# Altium project Plant.PrjPcb
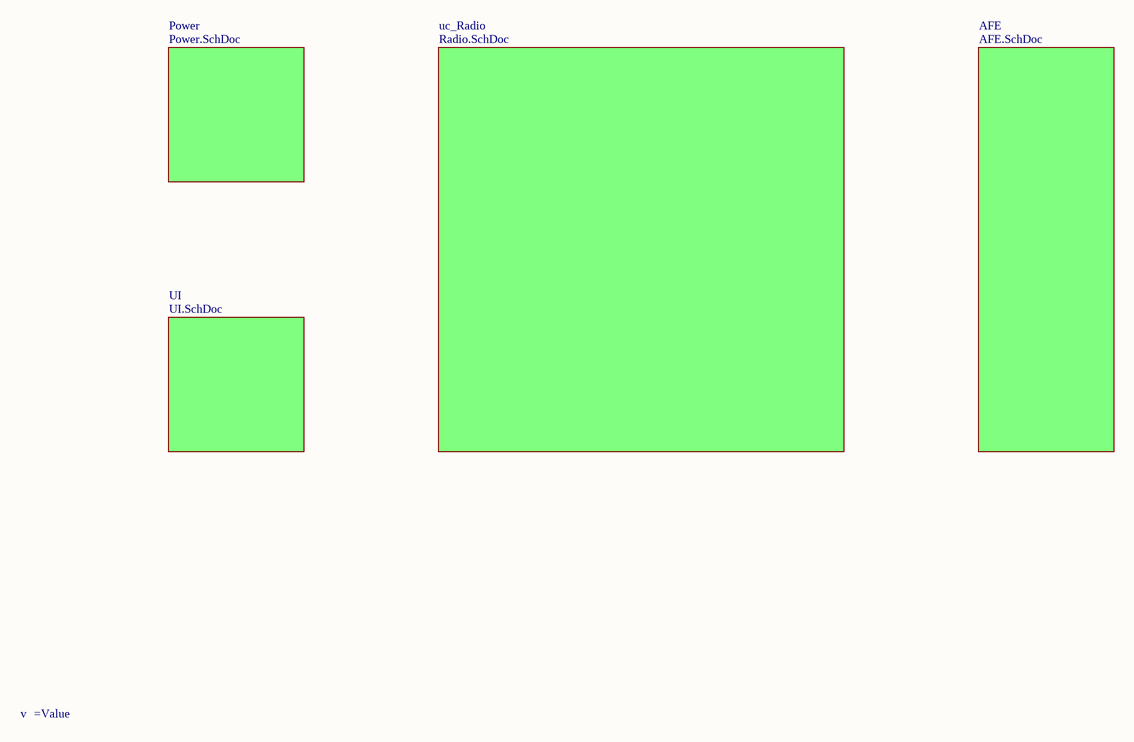
[diagram p0: Plant.SchDoc]
5 sheets, 30 parts. Net scope: global (net labels, ports and power ports of the same name join across sheets).
Board file: Plant.PcbDoc
Sheets:
  Plant.SchDoc
    uc_Radio = Radio.SchDoc
    Power = Power.SchDoc
    AFE = AFE.SchDoc
    UI = UI.SchDoc

## Sheet Plant.SchDoc: Plant - Block Diagram
size A4; Author: Carlos de la Fuente; DrawnBy: Carlos de la Fuente; Engineer: Carlos de la Fuente; DocumentNumber: 1; Revision: 0.2; SheetNumber: 1; SheetTotal: 5

### Parts
v  Version  [VERSION]  (value not drawn)  (no BOM)

### Sub-sheets
AFE = AFE.SchDoc: no entries
Power = Power.SchDoc: no entries
uc_Radio = Radio.SchDoc: no entries
UI = UI.SchDoc: no entries

### Notes on the sheet
- Title
- Size:
- Date:
- A4
- Project:
- Time:
- Sheet
- Drawn By:
- Revision:
- of
- File:

### Library data of the parts
v = Version: Silkscreen version; Value: 0.2; Part Number: Version; Revision Date: 15/04/2019; Creation Date: 15/04/2019

## Sheet Radio.SchDoc: Plant - Radio
size A4; Author: Carlos de la Fuente; DrawnBy: Carlos de la Fuente; DocumentNumber: Radio; Revision: 0.2; SheetNumber: 2; SheetTotal: 5
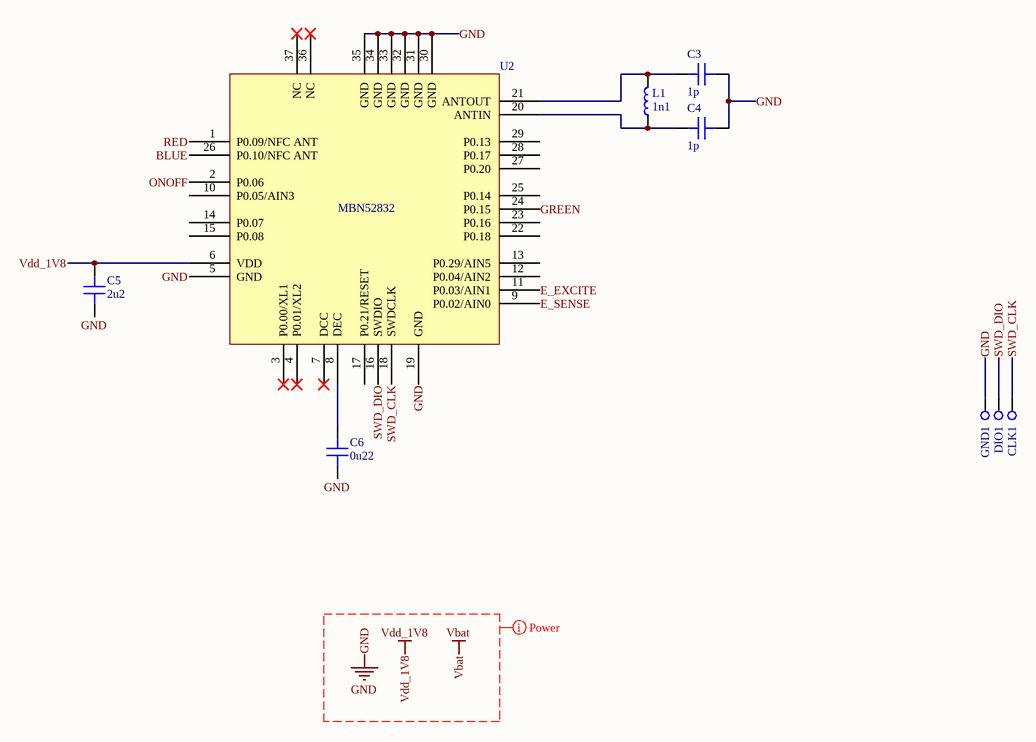
[diagram p1: Radio.SchDoc]

### Parts
C3  1p  [CAP 0201/0603]
C4  1p  [CAP 0201/0603]
C5  2u2  [CAP 0402/1005]
C6  0u22  [CAP 0201/0603]
CLK1  Test Point  [TP SMD 1MM]  (value not drawn)  (no BOM)
DIO1  Test Point  [TP SMD 1MM]  (value not drawn)  (no BOM)
GND1  Test Point  [TP SMD 1MM]  (value not drawn)  (no BOM)
L1  1n1  [FER 0402/1005]
U2  MBN52832  [Murata MBN52832]

### Nets
GND: C3.2 C4.2 C5.1 C6.1 GND1.1(TP) U2.5(GND) U2.19(GND) U2.30(GND) U2.31(GND) U2.32(GND) U2.33(GND) U2.34(GND) U2.35(GND)
Vdd_1V8: C5.2 U2.6(VDD)
BLUE: U2.26(P0.10/NFC_ANT)
E_EXCITE: U2.11(P0.03/AIN1)
E_SENSE: U2.9(P0.02/AIN0)
GREEN: U2.24(P0.15)
ONOFF: U2.2(P0.06)
RED: U2.1(P0.09/NFC_ANT)
SWD_CLK: CLK1.1(TP) U2.18(SWDCLK)
SWD_DIO: DIO1.1(TP) U2.16(SWDIO)
NetC3_1: C3.1 L1.2 U2.21(ANTOUT)
NetC4_1: C4.1 L1.1 U2.20(ANTIN)
NetC6_2: C6.2 U2.8(DEC)

Not connected (* = marked no-connect by the designer): U2 3(P0.00/XL1)* 4(P0.01/XL2)* 7(DCC)* 10(P0.05/AIN3) 12(P0.04/AIN2) 13(P0.29/AIN5) 14(P0.07) 15(P0.08) 17(P0.21/RESET) 22(P0.18) 23(P0.16) 25(P0.14) 27(P0.20) 28(P0.17) 29(P0.13) 36(NC)* 37(NC)*

### Layout directives
net class Power: GND, Vbat, Vdd_1V8

### Notes on the sheet
- Title
- Size:
- Date:
- A4
- Project:
- Time:
- Sheet
- Drawn By:
- Revision:
- of
- File:

### Library data of the parts
C3 C4 = GRM0335C1H1R0BA01D: CAP CER 0201 1pF 50V ±0.1pF C0G; Manufacturer: Murata; Value: 1p; Part Number: GRM0335C1H1R0BA01D; Creation Date: 02/07/2019; Revision Date: 02/07/2019; Supplier 1: Digi-Key; Supplier Part Number 1: 490-9660-1-ND; Manufacturer Part Number: GRM0335C1H1R0BA01D; Stock 1: 521200; Pricing 1: 1=0,10000, 10=0,02000, 100=0,00900, 500=0,00644, 1000=0,00506, 2500=0,00460, 5000=0,00423 (USD); RoHS: Yes; Mount: Surface Mount; Case/Package: 0201; Min Operating Temperature: -55°C; Max Operating Temperature: 125°C; Packaging: Tape and Reel; Voltage Rating (DC): 50V; Length: 0.024inch; Width: 0.012inch; Depth: 0.3mm; ComponentLink1URL: https://datasheet.ciiva.com/29538/partnumbering-e-01-29538566.pdf?src-supplier=Digi-Key; ComponentLink1Description: https://datasheet.ciiva.com/29538/partnumbering-e-01-29538566.pdf?src-supplier=Digi-Key; Case Code (Imperial): 0201; Case Code (Metric): 0603; Voltage Rating: 50V; Package Quantity: 15000; Termination: SMD/SMT; Capacitance: 1pF; Dielectric: C0G; Thickness: 0.013inch
C5 = GRM155R61C225KE11D: CAP CER 0402 2.2uF 16V 10% X5R; Manufacturer: Murata; Note: recommended; Material: Ceramic; Value: 2u2; Part Number: GRM155R61C225KE11D; Supplier 1: Digi-Key; Supplier Part Number 1: 490-10695-1-ND; Manufacturer Part Number: GRM155R61C225KE11D; Stock 1: 2251620; Pricing 1: 1=0,23000, 10=0,15900, 100=0,08990, 500=0,06348, 1000=0,05555, 2500=0,05290, 5000=0,04893 (USD); RoHS: Yes; Mount: Surface Mount; Case/Package: 0402; Min Operating Temperature: -55°C; Max Operating Temperature: 85°C; Tolerance: 10%; Packaging: Tape and Reel; Voltage Rating (DC): 16V; Length: 0.039inch; Height: 0.3mm; Width: 0.02inch; ComponentLink1URL: http://components.arrow.com/part/dataview/0323_07281440?src-supplier=Arrow+Europe; ComponentLink1Description: http://components.arrow.com/part/dataview/0323_07281440?src-supplier=Arrow+Europe; Case Code (Imperial): 0402; Case Code (Metric): 1005; Voltage Rating: 16V; Capacitance: 2.2uF; Thickness: 0.022inch; ComponentLink2URL: http://www.mouser.com/ds/2/281/c02e-2905.pdf?src-s; ComponentLink2Description: http://www.mouser.com/ds/2/281/c02e-2905.pdf?src-s; ComponentLink3URL: https://search.murata.co.jp/Ceramy/image/img/A01X/; ComponentLink3Description: https://search.murata.co.jp/Ceramy/image/img/A01X/; Creation Date: 10/10/2019; Revision Date: 10/10/2019
C6 = GRM033R61A224KE90D: CAP CER 0201 0.22uF 10V 10% X5R; Manufacturer: Murata; Note: recommended; Capacitance: 220nF; Value: 0u22; Part Number: GRM033R61A224KE90D; Creation Date: 19/01/2021; Revision Date: 19/01/2021; Supplier 1: Digi-Key; Supplier Part Number 1: 490-10411-1-ND; Manufacturer Part Number: GRM033R61A224KE90D; Stock 1: 951885; Pricing 1: 1=0,10000, 10=0,03600, 50=0,01980, 100=0,01620, 500=0,01156, 1000=0,00908, 2500=0,00825, 5000=0,00759 (USD); RoHS: Yes; Mount: Surface Mount; Case/Package: 0201; Min Operating Temperature: -55°C; Max Operating Temperature: 85°C; Tolerance: 10%; Packaging: Tape and Reel; Voltage Rating (DC): 10V; Length: 0.024inch; Height: 0.5mm; Width: 0.012inch; Lead Free: Lead Free; ComponentLink1URL: http://www.farnell.com/datasheets/2867835.pdf?src-supplier=Farnell; ComponentLink1Description: http://www.farnell.com/datasheets/2867835.pdf?src-supplier=Farnell; Case Code (Imperial): 0201; Case Code (Metric): 0603; Voltage Rating: 10V; Dielectric: X5R; Thickness: 0.013inch; ComponentLink2URL: http://www.mouser.com/ds/2/281/c02e-2905.pdf?src-s; ComponentLink2Description: http://www.mouser.com/ds/2/281/c02e-2905.pdf?src-s; ComponentLink3URL: http://search.murata.co.jp/Ceramy/image/img/A01X/G; ComponentLink3Description: http://search.murata.co.jp/Ceramy/image/img/A01X/G; ComponentLink4URL: http://www.farnell.com/datasheets/2867835.pdf?src-; ComponentLink4Description: http://www.farnell.com/datasheets/2867835.pdf?src-; ComponentLink5URL: http://www.mouser.com/ds/2/281/c02e-2905.pdf?src-s; ComponentLink5Description: http://www.mouser.com/ds/2/281/c02e-2905.pdf?src-s; ComponentLink6URL: http://search.murata.co.jp/Ceramy/image/img/A01X/G; ComponentLink6Description: http://search.murata.co.jp/Ceramy/image/img/A01X/G; ComponentLink7URL: http://search.murata.co.jp/Ceramy/image/img/A01X/p; ComponentLink7Description: http://search.murata.co.jp/Ceramy/image/img/A01X/p; Manufacturer 1: Murata; Manufacturer Part Number 1: GRM033R61A224KE90D; RoHS Compliant: Yes; Resistor Type: Ceramic
CLK1 DIO1 GND1 = TPSMD1: TP 1mm round pad; Part Number: TPSMD1; Value: TP; Revision Date: 03/07/2019; Creation Date: 08/05/2019
L1 = LQP03TN1N1B02D_mod: IND 0201 1.1nH +-0.1nH 0.75A 0.1R; Manufacturer: Murata; Core Material: Non-Magnetic; Self Resonant Frequency: 17GHz; Shielding: Unshielded; DC Resistance (DCR): 100mR; Q Factor: 14; Current Rating: 750mA; Test Frequency: 500MHz; Value: 1n1; Part Number: LQP03TN1N1B02D_mod; Creation Date: 10/10/2019; Revision Date: 10/10/2019; Supplier 1: Digi-Key; Supplier Part Number 1: 490-6715-1-ND; Manufacturer Part Number: LQP03TN1N1B02D; Stock 1: 87622; Pricing 1: 1=0,10000, 10=0,04700, 100=0,03110, 500=0,02588, 1000=0,02174, 2500=0,01863 (USD); RoHS: Yes; Mount: Surface Mount; Case/Package: 0201; Min Operating Temperature: -55°C; Max Operating Temperature: 125°C; Packaging: Tape and Reel; Case Code (Imperial): 0201; Case Code (Metric): 0603; Package Quantity: 15000; Termination: SMD/SMT; Composition: Thin Film; Inductance: 1.1nH; Max DC Current: 750mA
U2 = WSM-BL241-ADA-008: Bluetooth v5.0 (BLE) SMART SOC IoT/NFC 1Mbps 3.3V; Manufacturer: Murata; Frequency: 2.4GHz; Interface: I2C,SPI,UART; Sensitivity: -93dBm; Current - Receiving: 6mA; Current - Transmitting: 7mA; Memory Size: 64KB; Part Number: WSM-BL241-ADA-008; Revision Date: 10/10/2019; Creation Date: 10/10/2019; Supplier 1: Mouser; Supplier Part Number 1: 81-WSM-BL241-ADA-008; Manufacturer Part Number: WSM-BL241-ADA-008; Stock 1: 4518; Pricing 1: 1=10,84000, 10=9,78000, 25=8,93000, 50=8,93000, 10; RoHS: No; Case/Package: Module; Min Operating Temperature: -40°C; Max Operating Temperature: 85°C; Packaging: Cut Tape; Data Rate: 1Mbps; ComponentLink1URL: http://www.farnell.com/datasheets/2575837.pdf?src-; ComponentLink1Description: http://www.farnell.com/datasheets/2575837.pdf?src-; ComponentLink2URL: https://wireless.murata.com/RFM/data/mbn52832_prod; ComponentLink2Description: https://wireless.murata.com/RFM/data/mbn52832_prod; ComponentLink3URL: http://www.farnell.com/datasheets/2575837.pdf?src-; ComponentLink3Description: http://www.farnell.com/datasheets/2575837.pdf?src-; Mount: Surface Mount

## Sheet Power.SchDoc: Plant - Power
size A4; Author: Carlos de la Fuente; CompanyName: ekuore; DrawnBy: Carlos de la Fuente; Engineer: Carlos de la Fuente; Organization: eKuore; Revision: 0.2; SheetNumber: 3; SheetTotal: 5
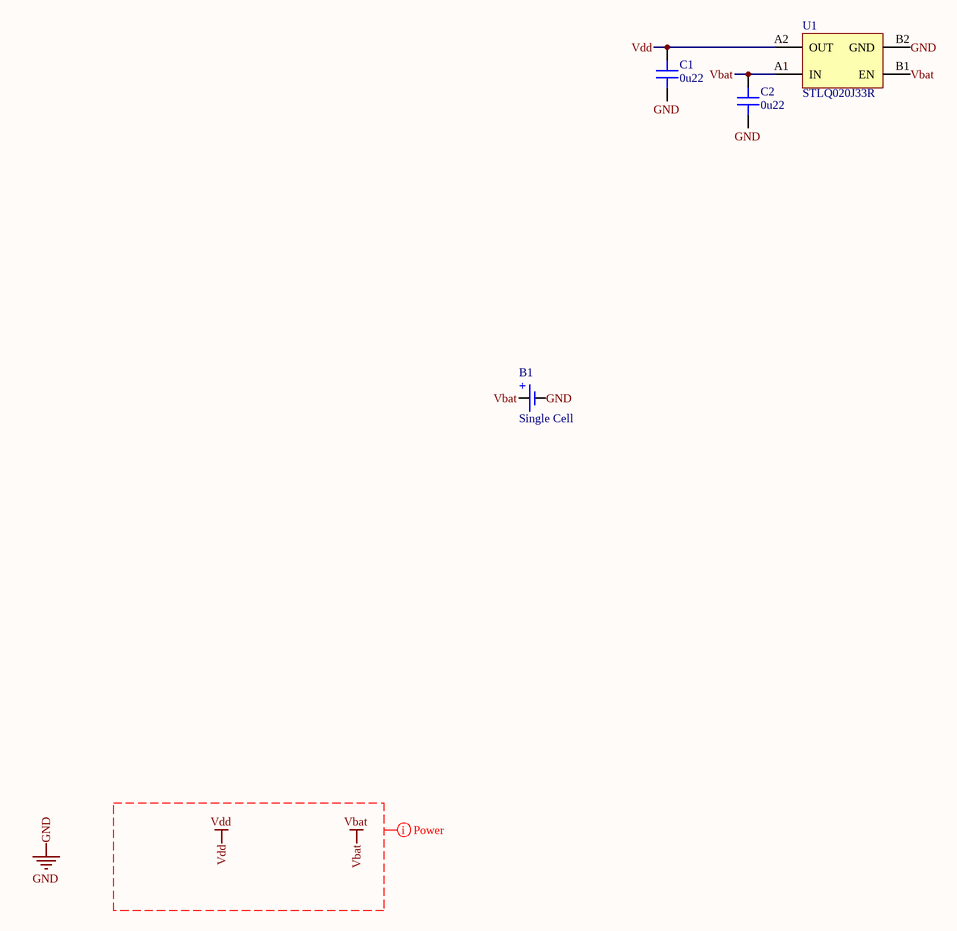
[diagram p2: Power.SchDoc]

### Parts
B1  Single Cell  [LINX BAT-HLD-012-SMT]
C1  0u22  [CAP 0201/0603]
C2  0u22  [CAP 0201/0603]
U1  STLQ020J33R  [ST flip-chip4]

### Nets
GND: B1.2(-) C1.1 C2.1 U1.B2(GND)
Vbat: B1.1(+) C2.2 U1.A1(IN) U1.B1(EN)
Vdd: C1.2 U1.A2(OUT)

### Layout directives
net class Power: Vbat, Vdd

### Notes on the sheet
- Title
- Size:
- Date:
- A4
- Project:
- Time:
- Sheet
- Drawn By:
- Revision:
- of
- File:

### Library data of the parts
B1 = BAT-HLD-012-SMT: CR1216, CR1225 Battery; Manufacturer: Linx; Number of Cells: 1; Part Number: BAT-HLD-012-SMT; Value: Battery; Revision Date: 22/06/2021; Creation Date: 22/06/2021; Supplier 1: Digi-Key; Supplier Part Number 1: BAT-HLD-012-SMT-ND; Manufacturer Part Number: BAT-HLD-012-SMT; Stock 1: 3192; RoHS: Yes; ComponentLink1URL: https://datasheet.ciiva.com/4642/bat-hld-012-smt20; ComponentLink1Description: https://datasheet.ciiva.com/4642/bat-hld-012-smt20; ComponentLink2URL: https://datasheet.ciiva.com/4/bat-hld-012-smt-4040; ComponentLink2Description: https://datasheet.ciiva.com/4/bat-hld-012-smt-4040; ComponentLink3URL: https://datasheet.ciiva.com/16418/bat-hld-012-smt-; ComponentLink3Description: https://datasheet.ciiva.com/16418/bat-hld-012-smt-; Manufacturer 1: Linx; Manufacturer Part Number 1: BAT-HLD-012-SMT; Mount: Surface Mount,PCB; Termination: SMD/SMT; Number of Batteries: 1; Package Quantity: 1000; Lead Free: Lead Free
C1 C2 = GRM033R61A224KE90D: as C6 on sheet Radio; Value: 0u22; Part Number: GRM033R61A224KE90D; Creation Date: 19/01/2021; Revision Date: 19/01/2021; Supplier 1: Digi-Key; Supplier Part Number 1: 490-10411-1-ND; Manufacturer Part Number: GRM033R61A224KE90D; Stock 1: 951885; Pricing 1: 1=0,10000, 10=0,03600, 50=0,01980, 100=0,01620, 500=0,01156, 1000=0,00908, 2500=0,00825, 5000=0,00759 (USD); RoHS: Yes; Mount: Surface Mount; Case/Package: 0201; Min Operating Temperature: -55°C; Max Operating Temperature: 85°C; Tolerance: 10%; Packaging: Tape and Reel; Voltage Rating (DC): 10V; Length: 0.024inch; Height: 0.5mm; Width: 0.012inch; Lead Free: Lead Free; ComponentLink1URL: http://www.farnell.com/datasheets/2867835.pdf?src-supplier=Farnell; ComponentLink1Description: http://www.farnell.com/datasheets/2867835.pdf?src-supplier=Farnell; Case Code (Imperial): 0201; Case Code (Metric): 0603; Voltage Rating: 10V; Dielectric: X5R; Thickness: 0.013inch; ComponentLink2URL: http://www.mouser.com/ds/2/281/c02e-2905.pdf?src-s; ComponentLink2Description: http://www.mouser.com/ds/2/281/c02e-2905.pdf?src-s; ComponentLink3URL: http://search.murata.co.jp/Ceramy/image/img/A01X/G; ComponentLink3Description: http://search.murata.co.jp/Ceramy/image/img/A01X/G; ComponentLink4URL: http://www.farnell.com/datasheets/2867835.pdf?src-; ComponentLink4Description: http://www.farnell.com/datasheets/2867835.pdf?src-; ComponentLink5URL: http://www.mouser.com/ds/2/281/c02e-2905.pdf?src-s; ComponentLink5Description: http://www.mouser.com/ds/2/281/c02e-2905.pdf?src-s; ComponentLink6URL: http://search.murata.co.jp/Ceramy/image/img/A01X/G; ComponentLink6Description: http://search.murata.co.jp/Ceramy/image/img/A01X/G; ComponentLink7URL: http://search.murata.co.jp/Ceramy/image/img/A01X/p; ComponentLink7Description: http://search.murata.co.jp/Ceramy/image/img/A01X/p; Manufacturer 1: Murata; Manufacturer Part Number 1: GRM033R61A224KE90D; RoHS Compliant: Yes; Resistor Type: Ceramic
U1 = STLQ020J33R: IC REG LIN 3.3V 200MA 4FLIPCHIP; Manufacturer: STMicroelectronics; Part Number: STLQ020J33R; Revision Date: 28/10/2019; Creation Date: 28/10/2019; Supplier 1: Digi-Key; Supplier Part Number 1: 497-18117-1-ND; Manufacturer Part Number: STLQ020J33R; Stock 1: 2546; Pricing 1: 1=0,57000, 10=0,49100, 100=0,36680, 500=0,28820, 1; RoHS: No; ComponentLink1URL: https://www.st.com/resource/en/datasheet/stlq020.p; ComponentLink1Description: https://www.st.com/resource/en/datasheet/stlq020.p

## Sheet AFE.SchDoc: Plant - AFE
size A4; Author: Carlos de la Fuente; CompanyName: ekuore; DrawnBy: Carlos de la Fuente; Engineer: Carlos de la Fuente; Organization: eKuore; Revision: 0.2; SheetNumber: 4; SheetTotal: 5
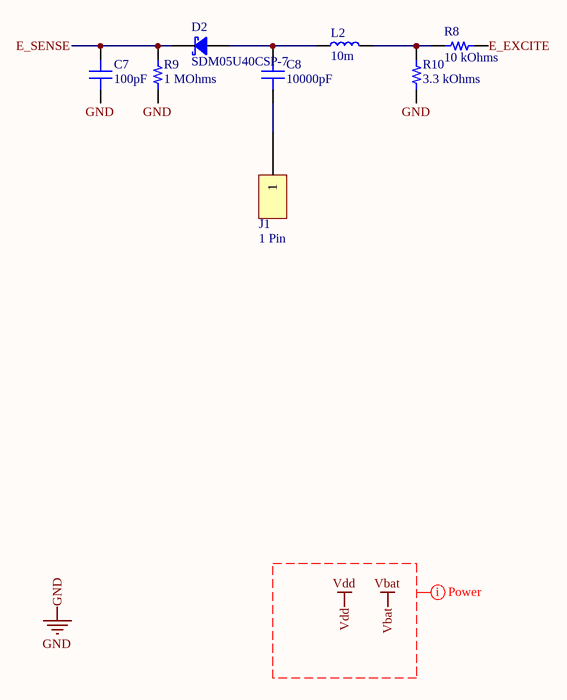
[diagram p3: AFE.SchDoc]

### Parts
C7  100pF  [CAP 0201_0603]
C8  10000pF  [CAP 0201_0603]
D2  SDM05U40CSP-7  [DIODES X3-WLB1006-2]
J1  1 Pin  [HARWIN P70-5100045R]
L2  10m  [IND BOURNS SDR0503]
R8  10 kOhms  [RES 0201_0603]
R9  1 MOhms  [RES 0201_0603]
R10  3.3 kOhms  [RES 0201_0603]

### Nets
GND: C7.1 R9.2 R10.1
E_EXCITE: R8.2
E_SENSE: C7.2 D2.1(K) R9.1
NetC8_1: C8.1 D2.2(A) L2.1
NetC8_2: C8.2 J1.1
NetL2_2: L2.2 R8.1 R10.2

### Layout directives
net class Power: Vbat, Vdd

### Notes on the sheet
- Title
- Size:
- Date:
- A4
- Project:
- Time:
- Sheet
- Drawn By:
- Revision:
- of
- File:

### Library data of the parts
C7 = GRM0335C1H101GA01D: CAP CER 100PF 50V C0G/NP0 0201; Manufacturer: Murata Electronics; Temperature Coefficient: C0G, NP0; Tolerance: ±2%; Part Number: GRM0335C1H101GA01D; Value: 100pF; Applications: General Purpose; Capacitance: 100pF; ComponentLink1Description: Datasheet; ComponentLink1URL: https://search.murata.co.jp/Ceramy/image/img/A01X/G101/ENG/GRM0335C1H101GA01-01.pdf; ComponentLink2Description: DigiKey Link; ComponentLink2URL: http://digikey.com/product-detail/en/murata-electronics/GRM0335C1H101GA01D/490-7751-1-ND/4357967; Device Package: 0201 (0603 Metric); LastUpdated: 02/09/2020 0:58:53; Lifecycle Status: Active; Minimum Order: 1; Mounting Type: Surface Mount, MLCC; Operating Temperature: -55°C ~ 125°C; Package / Case: 0201 (0603 Metric); Packaging: CutTape; PartId: 1001; Part Status: Active; Price: 0.10; Series: GRM; Size / Dimension: 0.024" L x 0.012" W (0.60mm x 0.30mm); Supplier 1: DigiKey; Supplier Part Number 1: 490-7751-1-ND; Thickness (Max): 0.013" (0.33mm); Voltage - Rated: 50V
C8 = GRM033R61A103KA01D: CAP CER 10000PF 10V X5R 0201; Manufacturer: Murata Electronics; Tolerance: ±10%; Part Number: GRM033R61A103KA01D; Value: 10000pF; Applications: General Purpose; Capacitance: 10000pF; ComponentLink1Description: Datasheet; ComponentLink1URL: https://www.murata.com/~/media/webrenewal/support/library/catalog/products/capacitor/mlcc/c02e.ashx?la=en-us; ComponentLink2Description: DigiKey Link; ComponentLink2URL: http://digikey.com/product-detail/en/murata-electronics/GRM033R61A103KA01D/490-3166-1-ND/702707; Device Package: 0201 (0603 Metric); LastUpdated: 02/09/2020 0:59:28; Lifecycle Status: Active; Minimum Order: 1; Mounting Type: Surface Mount, MLCC; Operating Temperature: -55°C ~ 85°C; Package / Case: 0201 (0603 Metric); Packaging: CutTape; PartId: 601; Part Status: Active; Price: 0.10; Series: GRM; Size / Dimension: 0.024" L x 0.012" W (0.60mm x 0.30mm); Supplier 1: DigiKey; Supplier Part Number 1: 490-3166-1-ND; Temperature Coefficient: X5R; Thickness (Max): 0.013" (0.33mm); Voltage - Rated: 10V
D2 = SDM05U40CSP-7: DIODE SCHTKY 40V 0.5A X3WLB1006; Manufacturer: Diodes; Capacitance: 3.5E-11F; Part Number: SDM05U40CSP-7; Revision Date: 19/07/2021; Creation Date: 19/07/2021; Supplier 1: Digi-Key; Supplier Part Number 1: SDM05U40CSP-7DICT-ND; Manufacturer Part Number: SDM05U40CSP-7; Stock 1: 220954; RoHS: Yes; Number of Pins: 2; Min Operating Temperature: -55°C; Max Operating Temperature: 150°C; Packaging: Tape and Reel; Mount: Surface Mount; Manufacturer 1: Diodes; Manufacturer Part Number 1: SDM05U40CSP-7
J1 = P70-5100045R: POGO PIN 4MM SMD; Manufacturer: Harwin; Plating: Gold; Current Rating: 2A; Part Number: P70-5100045R; Value: Pogo Pin; Creation Date: 22/06/2021; Revision Date: 22/06/2021; Supplier 1: Digi-Key; Supplier Part Number 1: 952-3125-ND; Manufacturer Part Number: P70-5100045; Stock 1: 2171; RoHS: Yes; Mount: Surface Mount; Material: Brass; Length: 4.8mm; REACH SVHC: No SVHC; ComponentLink1URL: https://cdn.harwin.com/pdfs/P70-510.pdf?src-supplier=Digi-Key; ComponentLink1Description: https://cdn.harwin.com/pdfs/P70-510.pdf?src-supplier=Digi-Key; ComponentLink2URL: http://www.farnell.com/datasheets/2151574.pdf?src-supplier=Element14; ComponentLink2Description: http://www.farnell.com/datasheets/2151574.pdf?src-supplier=Element14; Manufacturer 1: Harwin; Manufacturer Part Number 1: P70-5100045; RoHS Compliant: Yes
L2 = SDR0503-103JL: IND (0503) 10mH +-5% 0.04A 110R; Manufacturer: Bourns; Tolerance: 5%; Core Material: Ferrite; Self Resonant Frequency: 1MHz; Shielding: Unshielded; Q Factor: 30; Current Rating: 27mA; Test Frequency: 1kHz; Current: 59mA; Saturation Current: 40mA; Value: 10m; Part Number: SDR0503-103JL; Creation Date: 22/06/2021; Revision Date: 22/06/2021; Supplier 1: Digi-Key; Supplier Part Number 1: SDR0503-103JLCT-ND; Manufacturer Part Number: SDR0503-103JL; Stock 1: 3024; RoHS: Yes; Mount: Surface Mount; Case/Package: 0503; Number of Pins: 2; Min Operating Temperature: -40°C; Max Operating Temperature: 125°C; Resistance: 110R; Packaging: Tape and Reel; Length: 5mm; Height: 3.3mm; Width: 3mm; Depth: 5.1mm; REACH SVHC: No SVHC; ComponentLink1URL: https://datasheet.ciiva.com/8515/sdr0503-8515929.pdf?src-supplier=Avnet; ComponentLink1Description: https://datasheet.ciiva.com/8515/sdr0503-8515929.pdf?src-supplier=Avnet; Package Quantity: 500; Termination: SMD/SMT; Military Standard: Not; Height - Seated (Max): 0.13inch; Radiation Hardening: No; ComponentLink2URL: https://datasheet.ciiva.com/6691/sdr0503-6691389.p; ComponentLink2Description: https://datasheet.ciiva.com/6691/sdr0503-6691389.p; ComponentLink3URL: https://datasheet.ciiva.com/6691/sdr0503-6691390.p; ComponentLink3Description: https://datasheet.ciiva.com/6691/sdr0503-6691390.p; ComponentLink4URL: https://datasheet.ciiva.com/6691/sdr0503-6691391.p; ComponentLink4Description: https://datasheet.ciiva.com/6691/sdr0503-6691391.p; ComponentLink5URL: https://datasheet.ciiva.com/8517/sdr0503-8517757.p; ComponentLink5Description: https://datasheet.ciiva.com/8517/sdr0503-8517757.p; ComponentLink6URL: https://datasheet.ciiva.com/28535/1577670-28535983; ComponentLink6Description: https://datasheet.ciiva.com/28535/1577670-28535983; ComponentLink7URL: https://datasheet.ciiva.com/48691/001056092-da-01-; ComponentLink7Description: https://datasheet.ciiva.com/48691/001056092-da-01-; Inductance: 10mH; DC Resistance (DCR): 110R; Max DC Current: 27mA; DC Current: 27mA; Inductance Tolerance: 5%; Manufacturer 1: Bourns; Manufacturer Part Number 1: SDR0503-103JL; RoHS Compliant: Yes; Resistor Type: Wirewound; Series: SDR0503; Body Material: Ferrite; RMS Current (Irms): 27mA; Sample Rate (Hz): 1kHz; Diameter: 5mm
R8 = CRCW020110K0FNED: RES SMD 10K OHM 1% 1/20W 0201; Manufacturer: Vishay Dale; Power (Watts): 0.05W, 1/20W; Temperature Coefficient: ±200ppm/°C; Part Number: CRCW020110K0FNED; Value: 10 kOhms; ComponentLink1Description: Datasheet; ComponentLink1URL: http://www.vishay.com/docs/20052/crcw0201e3.pdf; ComponentLink2Description: DigiKey Link; ComponentLink2URL: http://digikey.com/product-detail/en/vishay-dale/CRCW020110K0FNED/541-10.0KABCT-ND/1183609; Composition: Thick Film; Device Package: 0201 (0603 Metric); Height - Seated (Max): 0.011" (0.28mm); LastUpdated: 02/09/2020 1:06:16; Lifecycle Status: Active; Minimum Order: 1; Number of Terminations: 2; Operating Temperature: -55°C ~ 155°C; Package / Case: 0201 (0603 Metric); Packaging: TapeAndReel; PartId: 2299; Part Status: Active; Price: 0.01; Resistance: 10 kOhms; Series: CRCW; Size / Dimension: 0.024" L x 0.012" W (0.60mm x 0.30mm); Supplier 1: DigiKey; Supplier Part Number 1: 541-10.0KABCT-ND; Supplier Device Package: 0201; Tolerance: ±1%
R9 = RMCF0201FT1M00: RES 1M OHM 1% 1/20W 0201; Manufacturer: Stackpole Electronics Inc; Power (Watts): 0.05W, 1/20W; Temperature Coefficient: ±200ppm/°C; Part Number: RMCF0201FT1M00; Value: 1 MOhms; ComponentLink1Description: Datasheet; ComponentLink1URL: https://www.seielect.com/catalog/sei-rmcf_rmcp.pdf; ComponentLink2Description: DigiKey Link; ComponentLink2URL: http://digikey.com/product-detail/en/stackpole-electronics-inc/RMCF0201FT1M00/RMCF0201FT1M00CT-ND/3905980; Composition: Thick Film; Device Package: 0201 (0603 Metric); Height - Seated (Max): 0.010" (0.26mm); LastUpdated: 02/09/2020 1:06:14; Lifecycle Status: Active; Minimum Order: 1; Number of Terminations: 2; Operating Temperature: -55°C ~ 125°C; Package / Case: 0201 (0603 Metric); Packaging: CutTape; PartId: 3123; Part Status: Active; Price: 0.10; Resistance: 1 MOhms; Series: RMCF; Size / Dimension: 0.024" L x 0.012" W (0.60mm x 0.30mm); Supplier 1: DigiKey; Supplier Part Number 1: RMCF0201FT1M00CT-ND; Supplier Device Package: 0201; Tolerance: ±1%
R10 = CRCW02013K30FNED: RES SMD 3.3K OHM 1% 1/20W 0201; Manufacturer: Vishay Dale; Power (Watts): 0.05W, 1/20W; Temperature Coefficient: ±200ppm/°C; Part Number: CRCW02013K30FNED; Value: 3.3 kOhms; ComponentLink1Description: Datasheet; ComponentLink1URL: http://www.vishay.com/docs/20052/crcw0201e3.pdf; ComponentLink2Description: DigiKey Link; ComponentLink2URL: http://digikey.com/product-detail/en/vishay-dale/CRCW02013K30FNED/541-CRCW02013K30FNEDCT-ND/10448664; Composition: Thick Film; Device Package: 0201 (0603 Metric); Height - Seated (Max): 0.011" (0.28mm); LastUpdated: 02/09/2020 1:06:17; Lifecycle Status: Active; Minimum Order: 1; Number of Terminations: 2; Operating Temperature: -55°C ~ 155°C; Package / Case: 0201 (0603 Metric); Packaging: TapeAndReel; PartId: 2040; Part Status: Active; Price: 0.01; Resistance: 3.3 kOhms; Series: CRCW; Size / Dimension: 0.024" L x 0.012" W (0.60mm x 0.30mm); Supplier 1: DigiKey; Supplier Part Number 1: 541-CRCW02013K30FNEDCT-ND; Supplier Device Package: 0201; Tolerance: ±1%

## Sheet UI.SchDoc: Plant - UI
size A4; Author: Carlos de la Fuente; CompanyName: eKuore; DrawnBy: Carlos de la Fuente; Engineer: Carlos de la Fuente; Organization: eKuore; Revision: 0.2; SheetNumber: 5; SheetTotal: 5
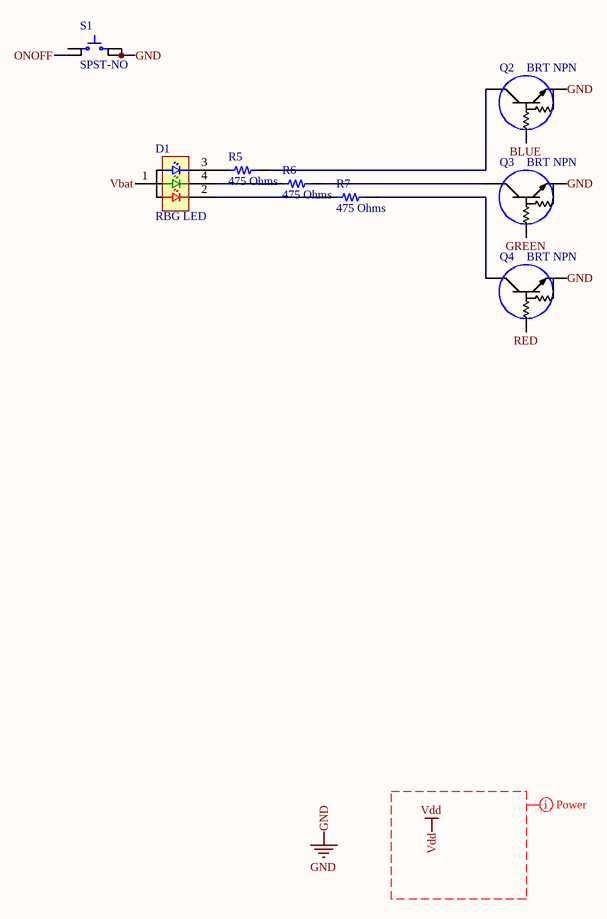
[diagram p4: UI.SchDoc]

### Parts
D1  RBG LED  [LED 0101/0404 RGB]
Q2  BRT NPN  [ON SEMI SOT-416]
Q3  BRT NPN  [ON SEMI SOT-416]
Q4  BRT NPN  [ON SEMI SOT-416]
R5  475 Ohms  [RES 0201_0603]
R6  475 Ohms  [RES 0201_0603]
R7  475 Ohms  [RES 0201_0603]
S1  SPST-NO  [Panasonic evqp7]

### Nets
GND: Q2.2(E) Q3.2(E) Q4.2(E) S1.2 S1.2'
Vbat: D1.1(A)
BLUE: Q2.1(B)
GREEN: Q3.1(B)
ONOFF: S1.1'
RED: Q4.1(B)
NetD1_2: D1.2(C2) R7.1
NetD1_3: D1.3(C3) R5.1
NetD1_4: D1.4(C4) R6.1
NetQ2_3: Q2.3(C) R5.2
NetQ3_3: Q3.3(C) R6.2
NetQ4_3: Q4.3(C) R7.2

Not connected (* = marked no-connect by the designer): S1 1

### Layout directives
net class Power: Vdd

### Notes on the sheet
- Title
- Size:
- Date:
- A4
- Project:
- Time:
- Sheet
- Drawn By:
- Revision:
- of
- File:

### Library data of the parts
D1 = SML-LX0404SIUPGUSB: LED 0404 RBG; Manufacturer: Lumex; Value: RGB; Color: Blue; Viewing Angle: 120°; Forward Current: 2mA; Forward Voltage: 2.73V; Luminous Intensity: 20mcd; Lens Style: Square; Number of LEDs: 3; Power Rating: 30mW; Lens Color: Colorless; Lens Transparency: Clear; Wavelength: 465nm; Part Number: SML-LX0404SIUPGUSB; Revision Date: 08/05/2019; Creation Date: 06/05/2019; Supplier 1: Digi-Key; Supplier Part Number 1: 67-2125-1-ND; Manufacturer Part Number: SML-LX0404SIUPGUSB; Stock 1: 106243; Pricing 1: 1 = 1,29000, 10 = 1,04700, 25 = 0,80560, 100 = 0,7; RoHS: Yes; Mount: Surface Mount; Case/Package: 0404; Case Code (Metric): 1010; Case Code (Imperial): 0404; Min Operating Temperature: -40°C; Max Operating Temperature: 85°C; Package Quantity: 2000; Packaging: Tape and Reel; Test Current: 2mA; Length: 1mm; Height: 0.3mm; Width: 1mm; Lead Free: Lead Free; ComponentLink1URL: https://datasheet.ciiva.com/1333/lumex-quasarbrite; ComponentLink1Description: https://datasheet.ciiva.com/1333/lumex-quasarbrite; ComponentLink2URL: https://datasheet.ciiva.com/4689/sml-lx0404siupgus; ComponentLink2Description: https://datasheet.ciiva.com/4689/sml-lx0404siupgus; ComponentLink3URL: https://datasheet.ciiva.com/1246/1423960-1246392.p; ComponentLink3Description: https://datasheet.ciiva.com/1246/1423960-1246392.p; ComponentLink4URL: https://datasheet.ciiva.com/2118/sml-lx0404siupgus; ComponentLink4Description: https://datasheet.ciiva.com/2118/sml-lx0404siupgus; ComponentLink5URL: https://datasheet.ciiva.com/16199/sml-lx0404siupgu; ComponentLink5Description: https://datasheet.ciiva.com/16199/sml-lx0404siupgu; ComponentLink6URL: https://datasheet.ciiva.com/14604/70127422-1460494; ComponentLink6Description: https://datasheet.ciiva.com/14604/70127422-1460494; REACH SVHC: No SVHC; ComponentLink7URL: https://datasheet.ciiva.com/1246/1484526-1246779.p; ComponentLink7Description: https://datasheet.ciiva.com/1246/1484526-1246779.p; ComponentLink8URL: https://datasheet.ciiva.com/2118/sml-lx0404siupgus; ComponentLink8Description: https://datasheet.ciiva.com/2118/sml-lx0404siupgus; ComponentLink9URL: https://datasheet.ciiva.com/2118/sml-lx0404siupgus; ComponentLink9Description: https://datasheet.ciiva.com/2118/sml-lx0404siupgus
Q2-Q4 = DTC114EET1G: TRANS PREBIAS NPN 200MW SC75; Manufacturer: ON Semiconductor; Collector Emitter Voltage (VCEO): 50V; Element Configuration: Single; hFE Min: 35; Max Collector Current: 100mA; Collector Emitter Saturation Voltage: 250mV; Current Rating: 70mA; Output Voltage: 300mV; Part Number: DTC114EET1G; Revision Date: 08/05/2019; Creation Date: 06/05/2019; Supplier 1: Digi-Key; Supplier Part Number 1: DTC114EET1GOSCT-ND; Manufacturer Part Number: DTC114EET1G; Stock 1: 38538; Pricing 1: 1 = 0,16000, 10 = 0,14200, 100 = 0,07730, 500 = 0,; RoHS: Yes; Case/Package: SOT-416; Number of Pins: 3; Contact Plating: Tin; Min Operating Temperature: -55°C; Max Operating Temperature: 150°C; Package Quantity: 1; Packaging: Tape and Reel; Max Power Dissipation: 200mW; Collector Emitter Breakdown Voltage: 50V; Polarity: NPN; Max Output Current: 100mA; Operating Supply Voltage: 50V; Max Breakdown Voltage: 50V; Continuous Collector Current: 100mA; Voltage Rating (DC): 50V; Length: 1.6mm; Height: 0.75mm; Width: 0.8mm; Radiation Hardening: No; Lead Free: Lead Free; Halogen Free: Halogen Free; REACH SVHC: No SVHC; ComponentLink1URL: https://datasheet.ciiva.com/15139/getdatasheetpart; ComponentLink1Description: https://datasheet.ciiva.com/15139/getdatasheetpart
R5-R7 = CRCW0201475RFKED: RES SMD 475 OHM 1% 1/20W 0201; Manufacturer: Vishay Dale; Power (Watts): 0.05W, 1/20W; Temperature Coefficient: ±100ppm/°C; Part Number: CRCW0201475RFKED; Value: 475 Ohms; ComponentLink1Description: Datasheet; ComponentLink1URL: http://www.vishay.com/docs/20052/crcw0201e3.pdf; ComponentLink2Description: DigiKey Link; ComponentLink2URL: http://digikey.com/product-detail/en/vishay-dale/CRCW0201475RFKED/541-475AABCT-ND/1968203; Composition: Thick Film; Device Package: 0201 (0603 Metric); Height - Seated (Max): 0.011" (0.28mm); LastUpdated: 02/09/2020 1:06:25; Lifecycle Status: Active; Minimum Order: 1; Number of Terminations: 2; Operating Temperature: -55°C ~ 155°C; Package / Case: 0201 (0603 Metric); Packaging: TapeAndReel; PartId: 82; Part Status: Active; Price: 0.03; Resistance: 475 Ohms; Series: CRCW; Size / Dimension: 0.024" L x 0.012" W (0.60mm x 0.30mm); Supplier 1: DigiKey; Supplier Part Number 1: 541-475AABCT-ND; Supplier Device Package: 0201; Tolerance: ±1%
S1 = EVQ-P7A01P: Switch Tactile N.O. SPST Right Angle 0.05A 12V; Manufacturer: Panasonic; Mechanical Life: 100000Cycles; Operating Force: 2.2N; Illumination Type: Non-Illuminated; Switch Travel: 0.2mm; Switch Function: Off-Mom; Contact Resistance: 500mR; Contact Current Rating: 50mA; Actuator Length: 0.65mm; Part Number: EVQ-P7A01P; Revision Date: 08/05/2019; Creation Date: 08/05/2019; Supplier 1: Digi-Key; Supplier Part Number 1: P16763CT-ND; Manufacturer Part Number: EVQ-P7A01P; Stock 1: 641; RoHS: Yes; Mount: Surface Mount; Case/Package: SMD/SMT; Min Operating Temperature: -20°C; Max Operating Temperature: 70°C; Packaging: Tape and Reel; Throw Configuration: SPST; Termination: Gull Wing; Package Quantity: 1; Orientation: Right Angle; ComponentLink1URL: https://datasheet.ciiva.com/30108/atk0000ce20-3010; ComponentLink1Description: https://datasheet.ciiva.com/30108/atk0000ce20-3010; Pricing 1: 1=0,30000, 10=0,28800, 25=0,27840, 50=0,26860, 100; Max Voltage Rating (DC): 12V; Electrical Life: 100000Cycles; Radiation Hardening: No; REACH SVHC: Unknown

## Nets that join several sheets
GND: Radio (13 pins), Power (B1.2 C1.1 C2.1 U1.B2), AFE (C7.1 R9.2 R10.1), UI (5 pins)
Vbat: Power (B1.1 C2.2 U1.A1 U1.B1), UI (D1.1)
BLUE: Radio (U2.26), UI (Q2.1)
E_EXCITE: Radio (U2.11), AFE (R8.2)
E_SENSE: Radio (U2.9), AFE (C7.2 D2.1 R9.1)
GREEN: Radio (U2.24), UI (Q3.1)
ONOFF: Radio (U2.2), UI (S1.1')
RED: Radio (U2.1), UI (Q4.1)